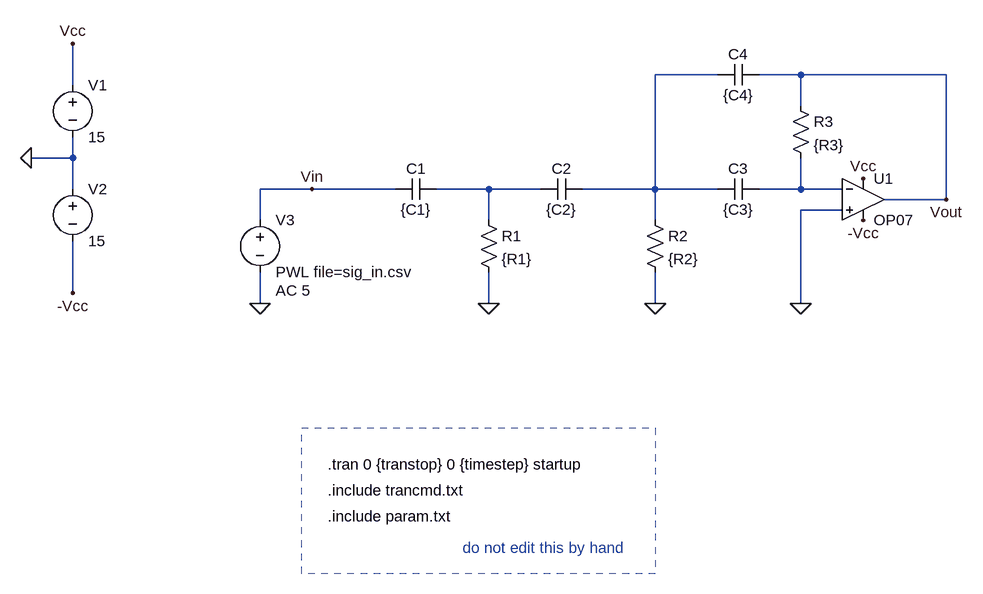
[diagram p0: schematic A10_AltaMFF_3.asc]
A10_AltaMFF_3.asc, the LTspice schematic file:
Version 4
SHEET 1 1256 680
WIRE 480 -96 384 -96
WIRE 608 -96 544 -96
WIRE 832 -96 608 -96
WIRE -512 -80 -512 -144
WIRE 608 -48 608 -96
WIRE -512 32 -512 0
WIRE -512 32 -576 32
WIRE -512 80 -512 32
WIRE -144 80 -224 80
WIRE -16 80 -144 80
WIRE 128 80 48 80
WIRE 208 80 128 80
WIRE 384 80 384 -96
WIRE 384 80 272 80
WIRE 480 80 384 80
WIRE 608 80 608 32
WIRE 608 80 544 80
WIRE 672 80 608 80
WIRE 832 96 832 -96
WIRE 832 96 736 96
WIRE 672 112 608 112
WIRE -224 128 -224 80
WIRE 128 128 128 80
WIRE 384 128 384 80
WIRE -512 240 -512 160
WIRE -224 256 -224 208
WIRE 128 256 128 208
WIRE 384 256 384 208
WIRE 608 256 608 112
FLAG -144 80 Vin
FLAG -576 32 0
FLAG -512 -144 Vcc
FLAG -512 240 -Vcc
FLAG -224 256 0
FLAG 384 256 0
FLAG 704 64 Vcc
FLAG 704 128 -Vcc
FLAG 832 96 Vout
FLAG 608 256 0
FLAG 128 256 0
SYMBOL res 112 112 R0
SYMATTR InstName R1
SYMATTR Value {R1}
SYMBOL cap -16 96 R270
WINDOW 0 32 32 VTop 2
WINDOW 3 0 32 VBottom 2
SYMATTR InstName C1
SYMATTR Value {C1}
SYMBOL OpAmps\\OP07 704 32 R0
SYMATTR InstName U1
SYMBOL cap 208 96 R270
WINDOW 0 32 32 VTop 2
WINDOW 3 0 32 VBottom 2
SYMATTR InstName C2
SYMATTR Value {C2}
SYMBOL voltage -512 -96 R0
WINDOW 123 0 0 Left 0
WINDOW 39 0 0 Left 0
SYMATTR InstName V1
SYMATTR Value 15
SYMBOL voltage -512 64 R0
WINDOW 123 0 0 Left 0
WINDOW 39 0 0 Left 0
SYMATTR InstName V2
SYMATTR Value 15
SYMBOL voltage -224 112 R0
WINDOW 123 24 124 Left 2
WINDOW 39 0 0 Left 0
SYMATTR Value2 AC 5
SYMATTR InstName V3
SYMATTR Value PWL file=sig_in.csv
SYMBOL res 368 112 R0
SYMATTR InstName R2
SYMATTR Value {R2}
SYMBOL cap 544 64 R90
WINDOW 0 0 32 VBottom 2
WINDOW 3 32 32 VTop 2
SYMATTR InstName C3
SYMATTR Value {C3}
SYMBOL res 592 -64 R0
SYMATTR InstName R3
SYMATTR Value {R3}
SYMBOL cap 544 -112 R90
WINDOW 0 0 32 VBottom 2
WINDOW 3 32 32 VTop 2
SYMATTR InstName C4
SYMATTR Value {C4}
TEXT -120 504 Left 2 !.tran 0 {transtop} 0 {timestep} startup
TEXT -120 584 Left 2 !.include param.txt
TEXT -120 544 Left 2 !.include trancmd.txt
TEXT 88 632 Left 2 ;do not edit this by hand
RECTANGLE Normal 384 672 -160 448 2

The netlist it stands for:
* A10_AltaMFF_3.asc
R1 N002 0 {R1}
C1 Vin N002 {C1}
XU1 0 N003 Vcc -Vcc Vout LT1001  ; OP07, pins In+ In- V+ V- OUT
C2 N002 N001 {C2}
V1 Vcc 0 15
V2 0 -Vcc 15
V3 Vin 0 PWL file=sig_in.csv AC 5
R2 N001 0 {R2}
C3 N003 N001 {C3}
R3 Vout N003 {R3}
C4 Vout N001 {C4}
.tran 0 {transtop} 0 {timestep} startup
.include param.txt
.include trancmd.txt
* do not edit this by hand
.lib LTC.lib
.backanno
.end

* Results of the author's LTspice run, read from the files saved beside the schematic
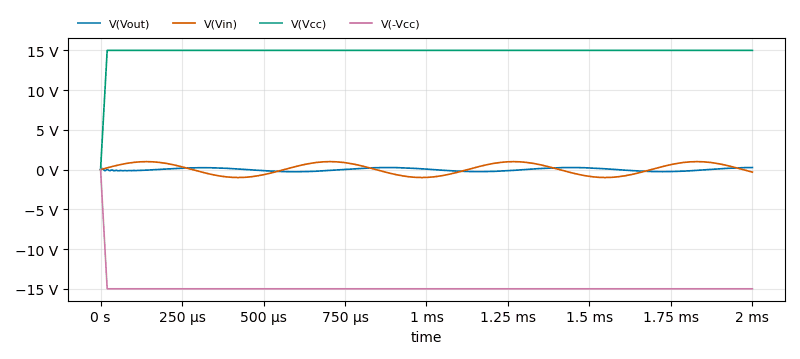
[diagram p1: Transient Analysis of A10_AltaMFF_3.asc, plotted from the saved traces]
* Transient Analysis, 1 run:
*   V(Vout): min -271.6 mV, max 260.3 mV, average -519.3 µV, rms 176.2 mV, last 258.3 mV
*   V(Vin): min -1 V, max 1 V, average 87.19 mV, rms 701.6 mV, last -319.2 mV
*   V(Vcc): min 0 V, max 15 V, average 14.93 V, rms 14.95 V, last 15 V
*   V(-Vcc): min -15 V, max 0 V, average -14.93 V, rms 14.95 V, last -15 V